# EAGLE schematic Schaltung_WasserAnalyse_V1_2 (EAGLE 9.5.1)
AUTHOR: Projektgruppe; DATE: 22.10.2019; PCB_NAME: LoRaWAN-Schwimmsensor; PROJECT_NAME: Schwimmsensor; PROJECT_NUMBER: 1; VERSION: 0
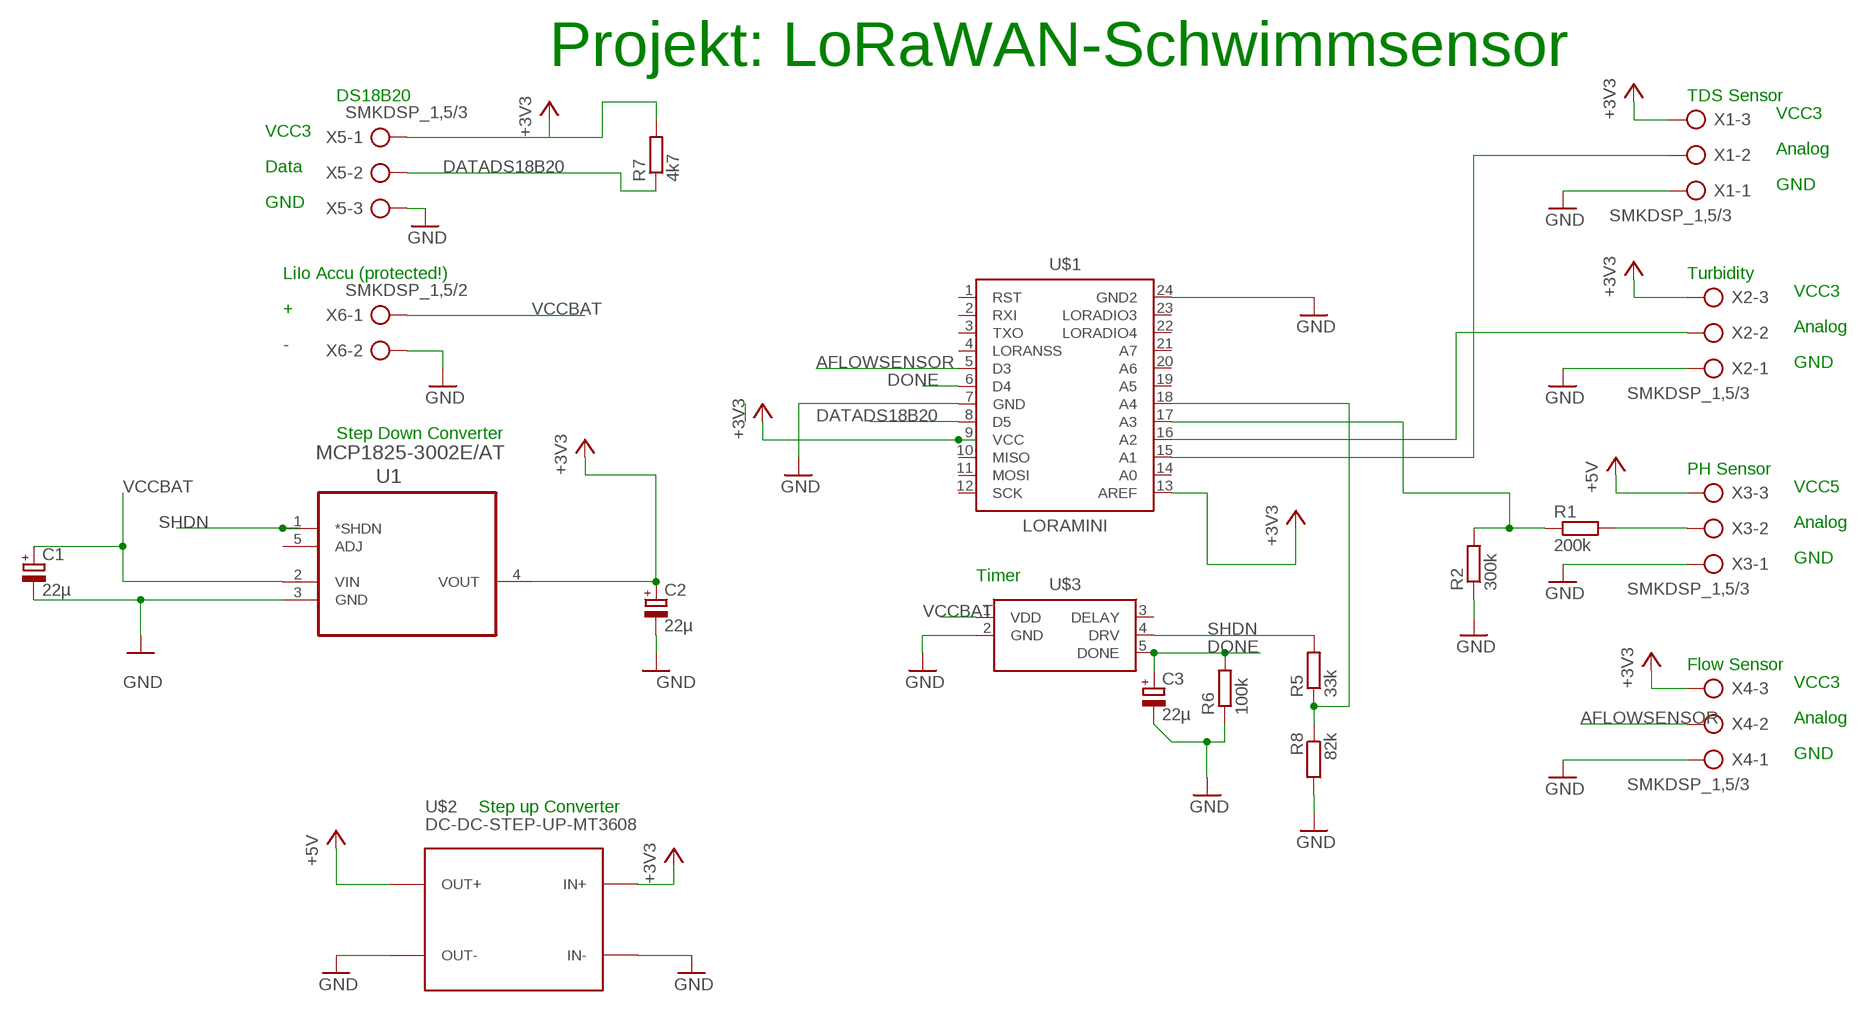
[diagram p0: schematic, sheet 1]

## Parts
C1  22µ  CPOL-EUE2.5-5  [E2,5-5]
C2  22µ  CPOL-EUE2.5-5  [E2,5-5]
C3  22µ  CPOL-EUE2.5-5  [E2,5-5]
R1  200k  R-EU_0411/15  [0411/15]
R2  300k  R-EU_0411/15  [0411/15]
R5  33k  R-EU_0411/15  [0411/15]
R6  100k  R-EU_0411/15  [0411/15]
R7  4k7  R-EU_0411/15  [0411/15]
R8  82k  R-EU_0411/15  [0411/15]
U1  MCP1825-3002E/AT  [TO170P482X1024X3124-5P]
U$1  LORAMINI  [LORAMINI]
U$2  DC-DC-STEP-UP-MT3608  [DC-DC-STEP-UP-MT3608]
U$3  ADAFRUITTP5110  [MODULE]
X1  SMKDSP_1,5/3  [SMKDSP_1,5/3]
X2  SMKDSP_1,5/3  [SMKDSP_1,5/3]
X3  SMKDSP_1,5/3  [SMKDSP_1,5/3]
X4  SMKDSP_1,5/3  [SMKDSP_1,5/3]
X5  SMKDSP_1,5/3  [SMKDSP_1,5/3]
X6  SMKDSP_1,5/2  [SMKDSP_1,5/2]

## Nets
+3V3: C2.+ R7.2 U1.4(VOUT) U$1.9(VCC) U$1.13(AREF) U$2.IN+ X1.3 X2.3 X4.3 X5.1
+5V: U$2.OUT+ X3.3
AFLOWSENSOR: U$1.5(D3) X4.2
DATADS18B20: R7.1 U$1.8(D5) X5.2
DONE: C3.+ R6.2 U$1.6(D4) U$3.5(DONE)
GND: C1.- C2.- C3.- R2.1 R6.1 R8.2 U1.3(GND) U$1.7(GND) U$1.24(GND2) U$2.IN- U$2.OUT- U$3.2(GND) X1.1 X2.1 X3.1 X4.1 X5.3 X6.2
N$2: R5.1 R8.1 U$1.18(A4)
N$3: U$1.15(A1) X1.2
N$4: U$1.16(A2) X2.2
N$6: R1.2 X3.2
N$7: R1.1 R2.2 U$1.17(A3)
SHDN: R5.2 U1.1(*SHDN) U$3.4(DRV)
VCCBAT: C1.+ U1.2(VIN) U$3.1(VDD) X6.1
Unconnected: U1.5(ADJ) U$1.1(RST) U$1.2(RXI) U$1.3(TXO) U$1.4(LORANSS) U$1.10(MISO) U$1.11(MOSI) U$1.12(SCK) U$1.14(A0) U$1.19(A5) U$1.20(A6) U$1.21(A7) U$1.22(LORADIO4) U$1.23(LORADIO3) U$3.3(DELAY)

## Notes on the sheet
- Projekt: LoRaWAN-Schwimmsensor
- DS18B20 | TDS Sensor
- VCC3
- VCC3
- Analog
- Data
- GND
- GND
- LiIo Accu (protected!) | Turbidity
- VCC3
- +
- Analog
- -
- GND
- Step Down Converter
- PH Sensor
- VCC5
- Analog
- GND
- Timer
- Flow Sensor
- VCC3
- Analog
- GND
- Step up Converter

## Library data of the parts
C1-C3 = rcl:CPOL-EU: POLARIZED CAPACITOR, European symbol
R1 R2 R5-R8 = rcl:R-EU_: RESISTOR, European symbol
U1 = MCP1825-3002E_AT:MCP1825-3002E/AT: IC, LDO, ADJ, 500MA; DESCRIPTION: Ic, Linear Regulator; Max. Input, 6v; Output, 3v; 500ma; Accuracy, 0.5%; To220-5; DIGI-KEY_PART_NUMBER: MCP1825-3002E/AT-ND; DIGI-KEY_PURCHASE_URL: https://www.digikey.com/product-detail/en/microchip-technology/MCP1825-3002E-AT/MCP1825-3002E-AT-ND/1636075?utm_source=snapeda&utm_medium=aggregator&utm_campaign=symbol; MF: Microchip; MP: MCP1825-3002E/AT; PACKAGE: TO-220 Microchip
U$1 = Dragino:LORAMINI
U$2 = diy-modules:DC-DC-STEP-UP-MT3608: DC/DC Step-Up Regulator based on MT3608 chip MT3608 datasheet available here: https://www.olimex.com/Products/Breadboarding/BB-PWR-3608/resources/MT3608.pdf Click here to find device on ebay.com <http://www.ebay.com/sch/mt3608+module>
U$3 = TPL5110:ADAFRUITTP5110
X1-X5 = con-phoenix-smkdsp:SMKDSP_1,5/3: Printklemme, Nennstrom: 17,5 A, Bemessungsspannung: 250 V, Raster: 5,0 mm Source: http://eshop.phoenixcontact.de .. 1733415.pdf; MF: FARNELL; MPN: 1733583; OC_FARNELL: 3041256; OC_NEWARK: 71C4130
X6 = con-phoenix-smkdsp:SMKDSP_1,5/2: Printklemme, Nennstrom: 17,5 A, Bemessungsspannung: 250 V, Raster: 5,0 mm Source: http://eshop.phoenixcontact.de .. 1733415.pdf; MF: FARNELL; MPN: 1733570; OC_FARNELL: 3041244; OC_NEWARK: 69C8588